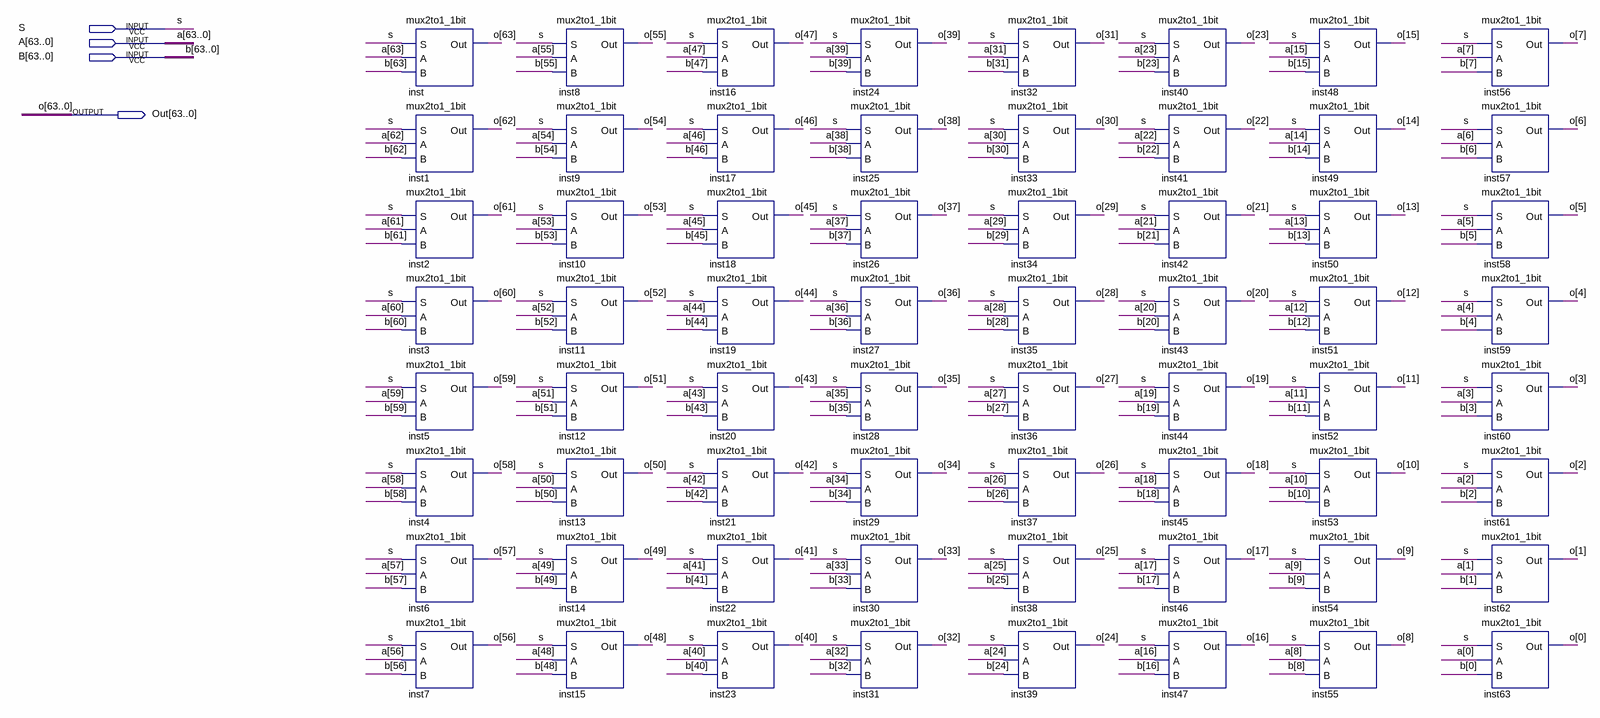
[diagram p0: schematic sheet]
// Quartus schematic mux2to1_64bit.bdf as structural Verilog: 64 symbols, 4 pins
module mux2to1_64bit (
  input  S,
  input  [63:0] A,
  input  [63:0] B,
  output [63:0] Out
);

  mux2to1_1bit inst (.S(S), .A(A[63]), .B(B[63]), .Out(Out[63]));
  mux2to1_1bit inst1 (.S(S), .A(A[62]), .B(B[62]), .Out(Out[62]));
  mux2to1_1bit inst2 (.S(S), .A(A[61]), .B(B[61]), .Out(Out[61]));
  mux2to1_1bit inst3 (.S(S), .A(A[60]), .B(B[60]), .Out(Out[60]));
  mux2to1_1bit inst5 (.S(S), .A(A[59]), .B(B[59]), .Out(Out[59]));
  mux2to1_1bit inst4 (.S(S), .A(A[58]), .B(B[58]), .Out(Out[58]));
  mux2to1_1bit inst6 (.S(S), .A(A[57]), .B(B[57]), .Out(Out[57]));
  mux2to1_1bit inst7 (.S(S), .A(A[56]), .B(B[56]), .Out(Out[56]));
  mux2to1_1bit inst8 (.S(S), .A(A[55]), .B(B[55]), .Out(Out[55]));
  mux2to1_1bit inst9 (.S(S), .A(A[54]), .B(B[54]), .Out(Out[54]));
  mux2to1_1bit inst10 (.S(S), .A(A[53]), .B(B[53]), .Out(Out[53]));
  mux2to1_1bit inst11 (.S(S), .A(A[52]), .B(B[52]), .Out(Out[52]));
  mux2to1_1bit inst12 (.S(S), .A(A[51]), .B(B[51]), .Out(Out[51]));
  mux2to1_1bit inst13 (.S(S), .A(A[50]), .B(B[50]), .Out(Out[50]));
  mux2to1_1bit inst14 (.S(S), .A(A[49]), .B(B[49]), .Out(Out[49]));
  mux2to1_1bit inst15 (.S(S), .A(A[48]), .B(B[48]), .Out(Out[48]));
  mux2to1_1bit inst16 (.S(S), .A(A[47]), .B(B[47]), .Out(Out[47]));
  mux2to1_1bit inst17 (.S(S), .A(A[46]), .B(B[46]), .Out(Out[46]));
  mux2to1_1bit inst18 (.S(S), .A(A[45]), .B(B[45]), .Out(Out[45]));
  mux2to1_1bit inst19 (.S(S), .A(A[44]), .B(B[44]), .Out(Out[44]));
  mux2to1_1bit inst20 (.S(S), .A(A[43]), .B(B[43]), .Out(Out[43]));
  mux2to1_1bit inst21 (.S(S), .A(A[42]), .B(B[42]), .Out(Out[42]));
  mux2to1_1bit inst22 (.S(S), .A(A[41]), .B(B[41]), .Out(Out[41]));
  mux2to1_1bit inst23 (.S(S), .A(A[40]), .B(B[40]), .Out(Out[40]));
  mux2to1_1bit inst24 (.S(S), .A(A[39]), .B(B[39]), .Out(Out[39]));
  mux2to1_1bit inst25 (.S(S), .A(A[38]), .B(B[38]), .Out(Out[38]));
  mux2to1_1bit inst26 (.S(S), .A(A[37]), .B(B[37]), .Out(Out[37]));
  mux2to1_1bit inst27 (.S(S), .A(A[36]), .B(B[36]), .Out(Out[36]));
  mux2to1_1bit inst28 (.S(S), .A(A[35]), .B(B[35]), .Out(Out[35]));
  mux2to1_1bit inst29 (.S(S), .A(A[34]), .B(B[34]), .Out(Out[34]));
  mux2to1_1bit inst30 (.S(S), .A(A[33]), .B(B[33]), .Out(Out[33]));
  mux2to1_1bit inst31 (.S(S), .A(A[32]), .B(B[32]), .Out(Out[32]));
  mux2to1_1bit inst32 (.S(S), .A(A[31]), .B(B[31]), .Out(Out[31]));
  mux2to1_1bit inst33 (.S(S), .A(A[30]), .B(B[30]), .Out(Out[30]));
  mux2to1_1bit inst34 (.S(S), .A(A[29]), .B(B[29]), .Out(Out[29]));
  mux2to1_1bit inst35 (.S(S), .A(A[28]), .B(B[28]), .Out(Out[28]));
  mux2to1_1bit inst36 (.S(S), .A(A[27]), .B(B[27]), .Out(Out[27]));
  mux2to1_1bit inst37 (.S(S), .A(A[26]), .B(B[26]), .Out(Out[26]));
  mux2to1_1bit inst38 (.S(S), .A(A[25]), .B(B[25]), .Out(Out[25]));
  mux2to1_1bit inst39 (.S(S), .A(A[24]), .B(B[24]), .Out(Out[24]));
  mux2to1_1bit inst40 (.S(S), .A(A[23]), .B(B[23]), .Out(Out[23]));
  mux2to1_1bit inst41 (.S(S), .A(A[22]), .B(B[22]), .Out(Out[22]));
  mux2to1_1bit inst42 (.S(S), .A(A[21]), .B(B[21]), .Out(Out[21]));
  mux2to1_1bit inst43 (.S(S), .A(A[20]), .B(B[20]), .Out(Out[20]));
  mux2to1_1bit inst44 (.S(S), .A(A[19]), .B(B[19]), .Out(Out[19]));
  mux2to1_1bit inst45 (.S(S), .A(A[18]), .B(B[18]), .Out(Out[18]));
  mux2to1_1bit inst46 (.S(S), .A(A[17]), .B(B[17]), .Out(Out[17]));
  mux2to1_1bit inst47 (.S(S), .A(A[16]), .B(B[16]), .Out(Out[16]));
  mux2to1_1bit inst48 (.S(S), .A(A[15]), .B(B[15]), .Out(Out[15]));
  mux2to1_1bit inst49 (.S(S), .A(A[14]), .B(B[14]), .Out(Out[14]));
  mux2to1_1bit inst50 (.S(S), .A(A[13]), .B(B[13]), .Out(Out[13]));
  mux2to1_1bit inst51 (.S(S), .A(A[12]), .B(B[12]), .Out(Out[12]));
  mux2to1_1bit inst52 (.S(S), .A(A[11]), .B(B[11]), .Out(Out[11]));
  mux2to1_1bit inst53 (.S(S), .A(A[10]), .B(B[10]), .Out(Out[10]));
  mux2to1_1bit inst54 (.S(S), .A(A[9]), .B(B[9]), .Out(Out[9]));
  mux2to1_1bit inst55 (.S(S), .A(A[8]), .B(B[8]), .Out(Out[8]));
  mux2to1_1bit inst56 (.S(S), .A(A[7]), .B(B[7]), .Out(Out[7]));
  mux2to1_1bit inst57 (.S(S), .A(A[6]), .B(B[6]), .Out(Out[6]));
  mux2to1_1bit inst58 (.S(S), .A(A[5]), .B(B[5]), .Out(Out[5]));
  mux2to1_1bit inst59 (.S(S), .A(A[4]), .B(B[4]), .Out(Out[4]));
  mux2to1_1bit inst60 (.S(S), .A(A[3]), .B(B[3]), .Out(Out[3]));
  mux2to1_1bit inst61 (.S(S), .A(A[2]), .B(B[2]), .Out(Out[2]));
  mux2to1_1bit inst62 (.S(S), .A(A[1]), .B(B[1]), .Out(Out[1]));
  mux2to1_1bit inst63 (.S(S), .A(A[0]), .B(B[0]), .Out(Out[0]));

  // Other names for the same wires on the sheet: o[63:0] = Out
endmodule
